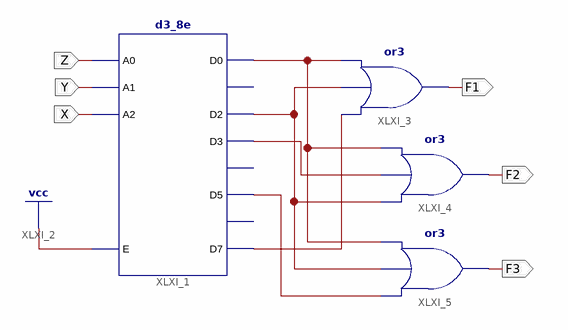
[diagram p0: schematic sheet 1]
// Xilinx ISE schematic C3_44.sch (kintex7) as structural Verilog: 4 symbols, 6 ports
module C3_44 (
  input  Z,
  input  Y,
  input  X,
  output F1,
  output F2,
  output F3
);

  wire XLXN_6, XLXN_7, XLXN_8, XLXN_9, XLXN_13;

  d3_8e XLXI_1 (
    .A0(Z), .A1(Y), .A2(X), .E(1'b1), .D0(XLXN_8), .D2(XLXN_6), .D3(XLXN_9), .D5(XLXN_13), .D7(XLXN_7));  // open: D1, D4, D6
  or XLXI_3 (F1, XLXN_7, XLXN_6, XLXN_8);
  or XLXI_4 (F2, XLXN_6, XLXN_9, XLXN_8);
  or XLXI_5 (F3, XLXN_13, XLXN_6, XLXN_8);
endmodule
